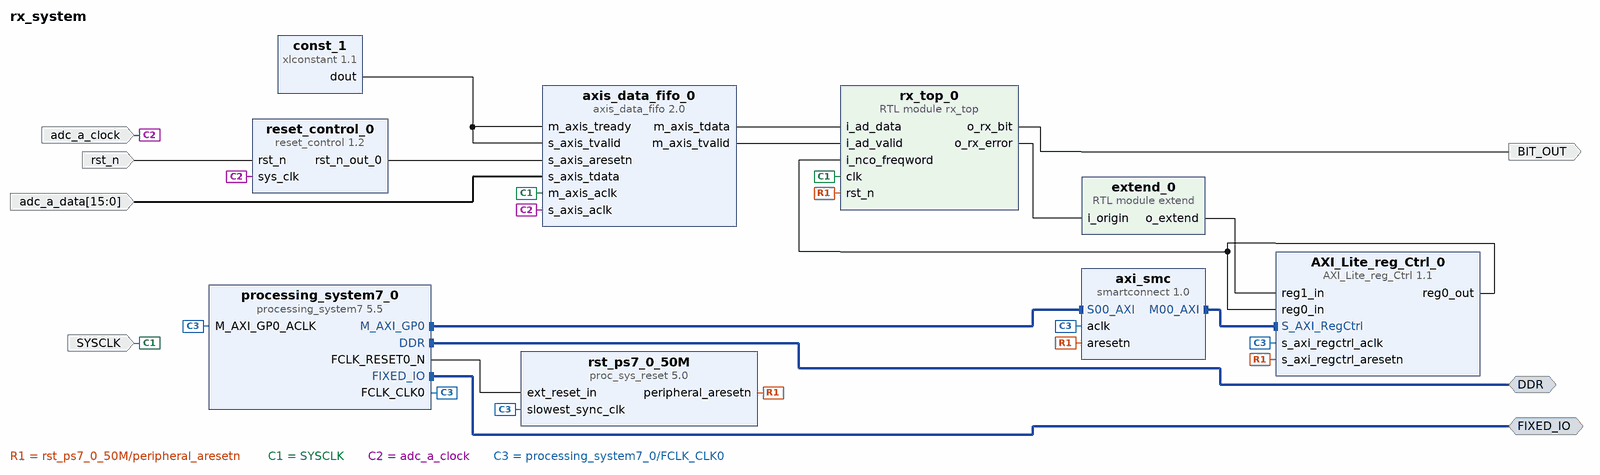
[diagram p0: block diagram of the top level]
# Vivado block design rx_system, xc7z010clg400-1, Vivado 2024.2
create_bd_design rx_system

create_bd_intf_port -mode Master -vlnv xilinx.com:interface:ddrx_rtl:1.0 DDR
create_bd_intf_port -mode Master -vlnv xilinx.com:display_processing_system7:fixedio_rtl:1.0 FIXED_IO
create_bd_port -dir I -type clk SYSCLK
set_property -dict {CONFIG.FREQ_HZ 147456000} [get_bd_ports SYSCLK]
create_bd_port -dir I -type clk adc_a_clock
set_property -dict {CONFIG.FREQ_HZ 73728000} [get_bd_ports adc_a_clock]
create_bd_port -dir I -from 15 -to 0 -type data adc_a_data
create_bd_port -dir I -type rst rst_n
create_bd_port -dir O BIT_OUT

create_bd_cell -type ip -vlnv xilinx.com:ip:processing_system7:5.5 processing_system7_0
set_property -dict [list \
  CONFIG.PCW_APU_PERIPHERAL_FREQMHZ 666.666666 \
  CONFIG.PCW_ENET0_PERIPHERAL_ENABLE 0 \
  CONFIG.PCW_FPGA0_PERIPHERAL_FREQMHZ 50 \
  CONFIG.PCW_FPGA1_PERIPHERAL_FREQMHZ 50 \
  CONFIG.PCW_GPIO_MIO_GPIO_ENABLE 1 \
  CONFIG.PCW_GPIO_MIO_GPIO_IO MIO \
  CONFIG.PCW_I2C1_I2C1_IO {MIO 28 .. 29} \
  CONFIG.PCW_I2C1_PERIPHERAL_ENABLE 1 \
  CONFIG.PCW_I2C_PERIPHERAL_FREQMHZ 111.111115 \
  CONFIG.PCW_I2C_RESET_ENABLE 1 \
  CONFIG.PCW_I2C_RESET_SELECT {Share reset pin} \
  CONFIG.PCW_PERIPHERAL_BOARD_PRESET None \
  CONFIG.PCW_PRESET_BANK1_VOLTAGE {LVCMOS 3.3V} \
  CONFIG.PCW_QSPI_GRP_SINGLE_SS_ENABLE 1 \
  CONFIG.PCW_QSPI_GRP_SINGLE_SS_IO {MIO 1 .. 6} \
  CONFIG.PCW_QSPI_PERIPHERAL_ENABLE 1 \
  CONFIG.PCW_QSPI_QSPI_IO {MIO 1 .. 6} \
  CONFIG.PCW_SD0_PERIPHERAL_ENABLE 0 \
  CONFIG.PCW_SINGLE_QSPI_DATA_MODE x4 \
  CONFIG.PCW_UART0_PERIPHERAL_ENABLE 1 \
  CONFIG.PCW_UART0_UART0_IO {MIO 34 .. 35} \
  CONFIG.PCW_UART1_PERIPHERAL_ENABLE 1 \
  CONFIG.PCW_UART1_UART1_IO {MIO 36 .. 37} \
  CONFIG.PCW_UART_PERIPHERAL_FREQMHZ 100 \
  CONFIG.PCW_UIPARAM_DDR_FREQ_MHZ 533.333333 \
  CONFIG.PCW_UIPARAM_DDR_PARTNO {MT41J128M8 JP-125} \
  CONFIG.PCW_USB0_PERIPHERAL_ENABLE 0 \
  CONFIG.PCW_USB_RESET_ENABLE 1 \
] [get_bd_cells processing_system7_0]
# 498 more settings of processing_system7_0 are not shown: defaults, MIO pin electricals, DDR timing, and values the tool derives
create_bd_cell -type ip -vlnv xilinx.com:user:AXI_Lite_reg_Ctrl:1.1 AXI_Lite_reg_Ctrl_0
create_bd_cell -type module -reference rx_top rx_top_0
create_bd_cell -type ip -vlnv xilinx.com:ip:smartconnect:1.0 axi_smc
set_property -dict {CONFIG.NUM_SI 1} [get_bd_cells axi_smc]
create_bd_cell -type ip -vlnv xilinx.com:ip:proc_sys_reset:5.0 rst_ps7_0_50M
create_bd_cell -type ip -vlnv xilinx.com:ip:axis_data_fifo:2.0 axis_data_fifo_0
set_property -dict [list \
  CONFIG.FIFO_DEPTH 64 \
  CONFIG.HAS_TKEEP 0 \
  CONFIG.HAS_TLAST 0 \
  CONFIG.HAS_TSTRB 0 \
  CONFIG.IS_ACLK_ASYNC 1 \
  CONFIG.TDATA_NUM_BYTES 2 \
] [get_bd_cells axis_data_fifo_0]
create_bd_cell -type ip -vlnv xilinx.com:ip:xlconstant:1.1 const_1
create_bd_cell -type ip -vlnv xilinx.com:user:reset_control:1.2 reset_control_0
set_property -dict {CONFIG.OUTPUT_WIDTH 1 CONFIG.RESET_HOLD_CYCLE 4} [get_bd_cells reset_control_0]
create_bd_cell -type module -reference extend extend_0

# ---- connections ----

connect_bd_intf_net [get_bd_intf_pins axi_smc/M00_AXI] [get_bd_intf_pins AXI_Lite_reg_Ctrl_0/S_AXI_RegCtrl]
connect_bd_intf_net [get_bd_intf_ports DDR] [get_bd_intf_pins processing_system7_0/DDR]
connect_bd_intf_net [get_bd_intf_ports FIXED_IO] [get_bd_intf_pins processing_system7_0/FIXED_IO]
connect_bd_intf_net [get_bd_intf_pins processing_system7_0/M_AXI_GP0] [get_bd_intf_pins axi_smc/S00_AXI]
connect_bd_net [get_bd_pins AXI_Lite_reg_Ctrl_0/reg0_out] [get_bd_pins AXI_Lite_reg_Ctrl_0/reg0_in] [get_bd_pins rx_top_0/i_nco_freqword]
connect_bd_net [get_bd_pins rst_ps7_0_50M/peripheral_aresetn] \
  [get_bd_pins AXI_Lite_reg_Ctrl_0/s_axi_regctrl_aresetn] [get_bd_pins axi_smc/aresetn] [get_bd_pins rx_top_0/rst_n]
connect_bd_net [get_bd_ports SYSCLK] [get_bd_pins axis_data_fifo_0/m_axis_aclk] [get_bd_pins rx_top_0/clk]
connect_bd_net [get_bd_ports adc_a_clock] [get_bd_pins axis_data_fifo_0/s_axis_aclk] [get_bd_pins reset_control_0/sys_clk]
connect_bd_net [get_bd_ports adc_a_data] [get_bd_pins axis_data_fifo_0/s_axis_tdata]
connect_bd_net [get_bd_pins axis_data_fifo_0/m_axis_tdata] [get_bd_pins rx_top_0/i_ad_data]
connect_bd_net [get_bd_pins axis_data_fifo_0/m_axis_tvalid] [get_bd_pins rx_top_0/i_ad_valid]
connect_bd_net [get_bd_pins const_1/dout] [get_bd_pins axis_data_fifo_0/s_axis_tvalid] [get_bd_pins axis_data_fifo_0/m_axis_tready]
connect_bd_net [get_bd_pins extend_0/o_extend] [get_bd_pins AXI_Lite_reg_Ctrl_0/reg1_in]
connect_bd_net [get_bd_pins processing_system7_0/FCLK_CLK0] \
  [get_bd_pins processing_system7_0/M_AXI_GP0_ACLK] [get_bd_pins axi_smc/aclk] \
  [get_bd_pins AXI_Lite_reg_Ctrl_0/s_axi_regctrl_aclk] [get_bd_pins rst_ps7_0_50M/slowest_sync_clk]
connect_bd_net [get_bd_pins processing_system7_0/FCLK_RESET0_N] [get_bd_pins rst_ps7_0_50M/ext_reset_in]
connect_bd_net [get_bd_pins reset_control_0/rst_n_out_0] [get_bd_pins axis_data_fifo_0/s_axis_aresetn]
connect_bd_net [get_bd_ports rst_n] [get_bd_pins reset_control_0/rst_n]
connect_bd_net [get_bd_pins rx_top_0/o_rx_bit] [get_bd_ports BIT_OUT]
connect_bd_net [get_bd_pins rx_top_0/o_rx_error] [get_bd_pins extend_0/i_origin]

# ---- address map ----
assign_bd_address -offset 0x43C00000 -range 64K -target_address_space [get_bd_addr_spaces processing_system7_0/Data] [get_bd_addr_segs AXI_Lite_reg_Ctrl_0/S_AXI_RegCtrl/S_AXI_RegCtrl_reg]

validate_bd_design
save_bd_design
